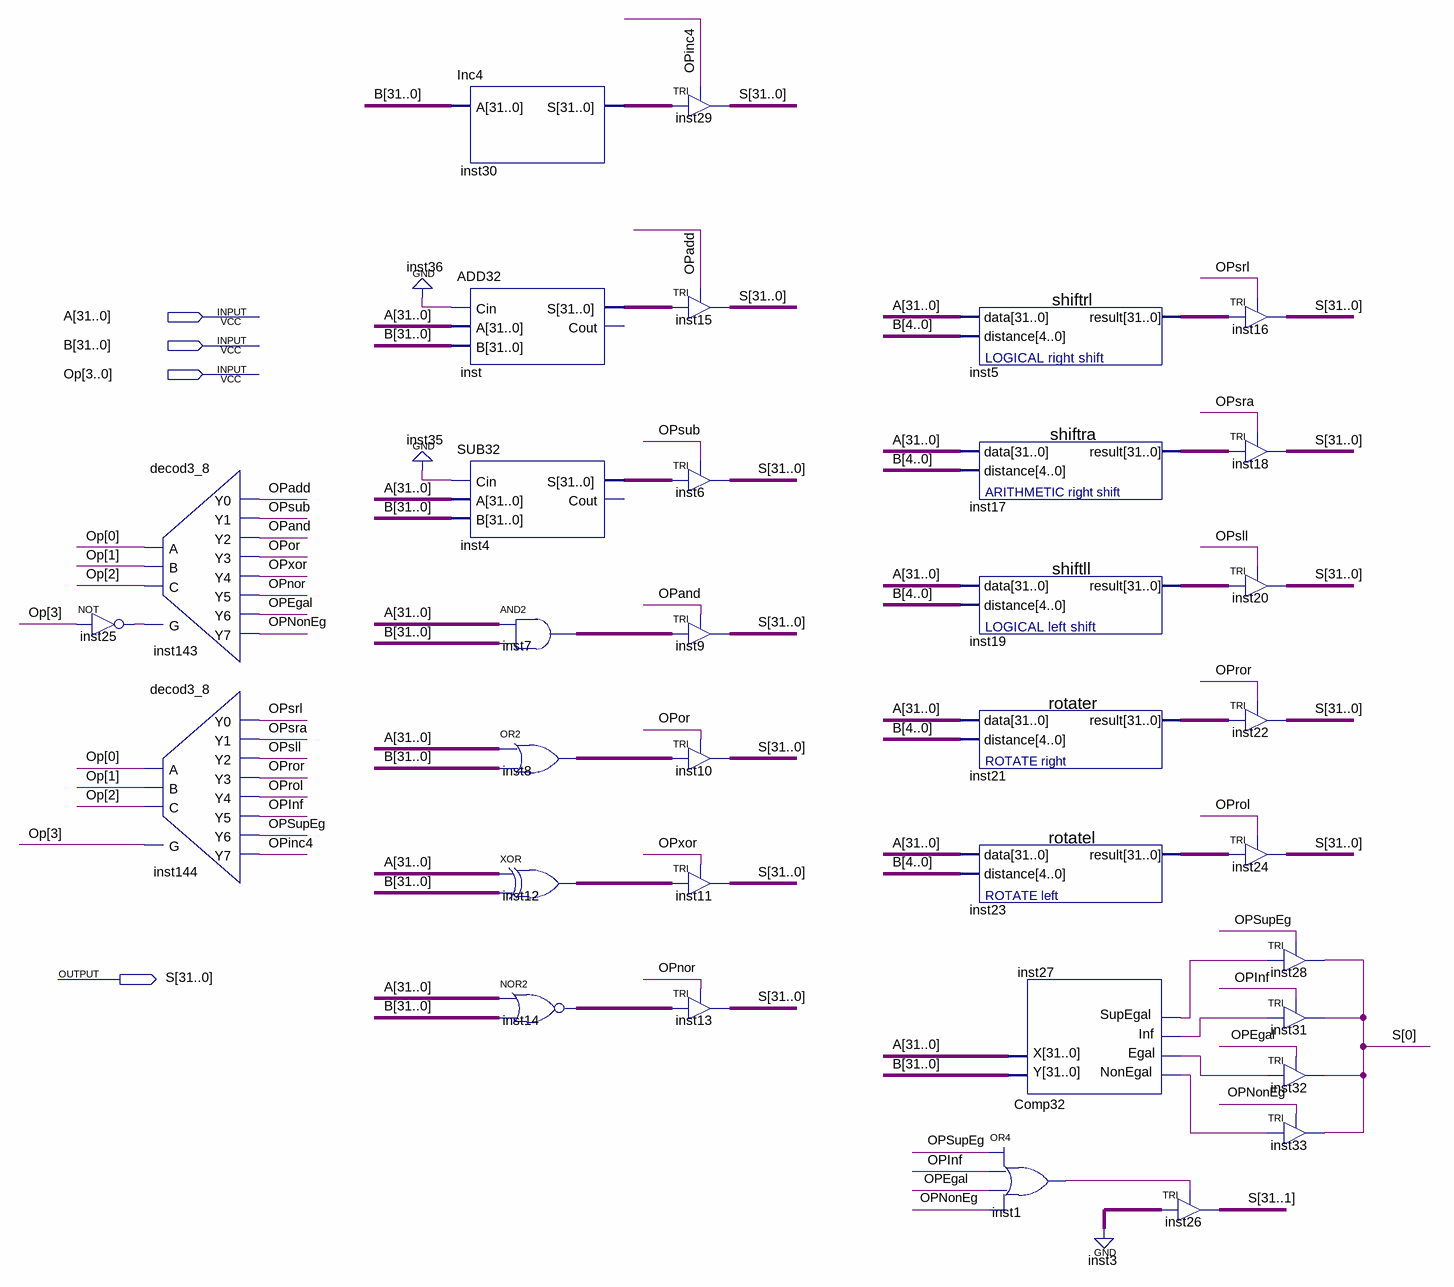
[diagram p0: schematic sheet]
// Quartus schematic UAL.bdf as structural Verilog: 34 symbols, 4 pins
module UAL (
  input  [31:0] A,
  input  [31:0] B,
  input  [3:0] Op,
  output [31:0] S
);

  wire inst1_out, inst25_out, inst27_egal, inst27_inf, inst27_nonegal, inst27_supegal, OPadd, OPand, OPEgal,
       OPinc4, OPInf, OPNonEg, OPnor, OPor, OProl, OPror, OPsll, OPsra, OPsrl, OPsub, OPSupEg, OPxor;
  wire [31:0] inst4_s, inst5_result, inst7_out, inst8_out, inst12_out, inst14_out, inst17_result,
       inst19_result, inst21_result, inst23_result, inst30_s, inst_s;

  not inst25 (inst25_out, Op[3]);
  decod3_8 inst143 (
    .G(inst25_out), .A(Op[0]), .B(Op[1]), .C(Op[2]), .Y0(OPadd), .Y1(OPsub), .Y2(OPand), .Y3(OPor),
    .Y4(OPxor), .Y5(OPnor), .Y6(OPEgal), .Y7(OPNonEg));
  decod3_8 inst144 (
    .G(Op[3]), .A(Op[0]), .B(Op[1]), .C(Op[2]), .Y0(OPsrl), .Y1(OPsra), .Y2(OPsll), .Y3(OPror), .Y4(OProl),
    .Y5(OPInf), .Y6(OPSupEg), .Y7(OPinc4));
  Inc4 inst30 (.A(B), .S(inst30_s));
  ADD32 inst (.Cin(1'b0), .A(A), .B(B), .S(inst_s));  // open: Cout
  SUB32 inst4 (.Cin(1'b0), .A(A), .B(B), .S(inst4_s));  // open: Cout
  assign inst7_out = A & B;  // AND2 inst7, 32 bits wide
  assign inst8_out = A | B;  // OR2 inst8, 32 bits wide
  assign inst12_out = A ^ B;  // XOR inst12, 32 bits wide
  assign inst14_out = ~(A | B);  // NOR2 inst14, 32 bits wide
  TRI inst29[31:0] (.IN(inst30_s), .OE(OPinc4), .OUT(S));
  TRI inst15[31:0] (.IN(inst_s), .OE(OPadd), .OUT(S));
  TRI inst6[31:0] (.IN(inst4_s), .OE(OPsub), .OUT(S));
  TRI inst9[31:0] (.IN(inst7_out), .OE(OPand), .OUT(S));
  TRI inst10[31:0] (.IN(inst8_out), .OE(OPor), .OUT(S));
  TRI inst11[31:0] (.IN(inst12_out), .OE(OPxor), .OUT(S));
  TRI inst13[31:0] (.IN(inst14_out), .OE(OPnor), .OUT(S));
  shiftrl inst5 (.data(A), .distance(B[4:0]), .result(inst5_result));
  shiftra inst17 (.data(A), .distance(B[4:0]), .result(inst17_result));
  shiftll inst19 (.data(A), .distance(B[4:0]), .result(inst19_result));
  rotater inst21 (.data(A), .distance(B[4:0]), .result(inst21_result));
  rotatel inst23 (.data(A), .distance(B[4:0]), .result(inst23_result));
  Comp32 inst27 (
    .Y(B), .X(A), .NonEgal(inst27_nonegal), .Egal(inst27_egal), .Inf(inst27_inf), .SupEgal(inst27_supegal));
  or inst1 (inst1_out, OPSupEg, OPInf, OPEgal, OPNonEg);
  TRI inst26[30:0] (.IN({31{1'b0}}), .OE(inst1_out), .OUT(S[31:1]));
  TRI inst16[31:0] (.IN(inst5_result), .OE(OPsrl), .OUT(S));
  TRI inst18[31:0] (.IN(inst17_result), .OE(OPsra), .OUT(S));
  TRI inst20[31:0] (.IN(inst19_result), .OE(OPsll), .OUT(S));
  TRI inst22[31:0] (.IN(inst21_result), .OE(OPror), .OUT(S));
  TRI inst24[31:0] (.IN(inst23_result), .OE(OProl), .OUT(S));
  TRI inst28 (.IN(inst27_supegal), .OE(OPSupEg), .OUT(S[0]));
  TRI inst31 (.IN(inst27_inf), .OE(OPInf), .OUT(S[0]));
  TRI inst32 (.IN(inst27_egal), .OE(OPEgal), .OUT(S[0]));
  TRI inst33 (.IN(inst27_nonegal), .OE(OPNonEg), .OUT(S[0]));
endmodule
